# Altium schematic sheet 野火_H743X_核心板_V1.0_底板原理图和PCB参考设计_AD格式.SchDoc
size 419 x 297 mm
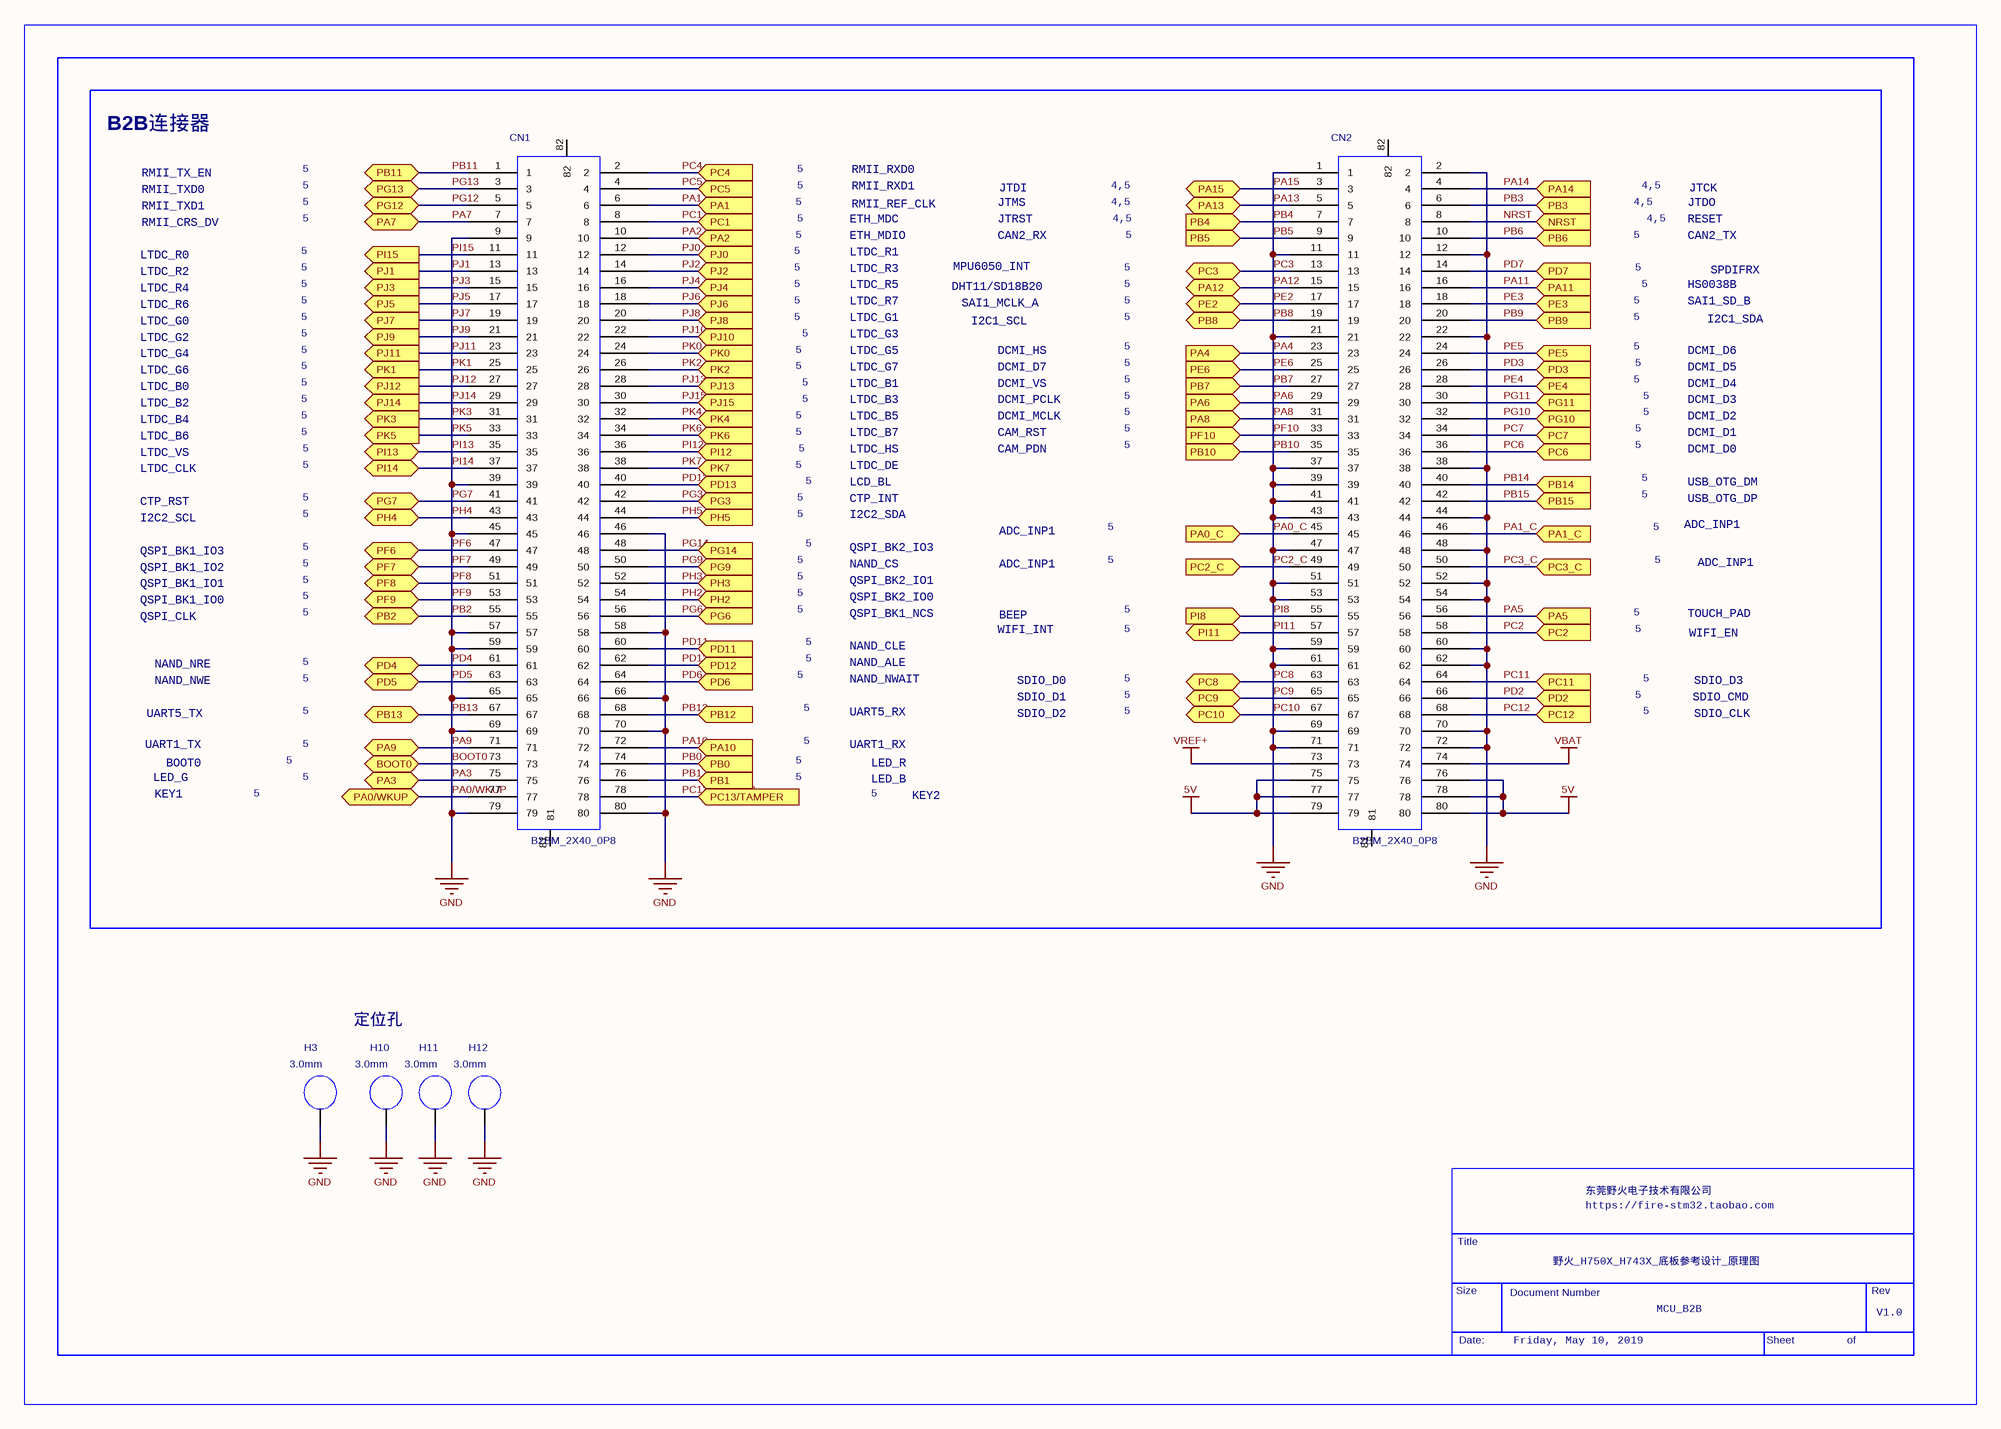
[diagram p0: 野火_H743X_核心板_V1.0_底板原理图和PCB参考设计_AD格式.SchDoc]

## Parts
CN1  value B2BM_2X40_0P8  [B2BM-2X40-0P8]  (hidden comment: B2BF_2X40_0)
CN2  value B2BM_2X40_0P8  [B2BM-2X40-0P8]  (hidden comment: B2BF_2X40_0)
H3  value 3.0mm  [T4R2-6R2_TOPSMT]  (hidden comment: SPACER_0)
H10  value 3.0mm  [T4R2-6R2_TOPSMT]  (hidden comment: SPACER_0)
H11  value 3.0mm  [T4R2-6R2_TOPSMT]  (hidden comment: SPACER_0)
H12  value 3.0mm  [T4R2-6R2_TOPSMT]  (hidden comment: SPACER_0)

## Blocks framed on the sheet
B2B连接器: CN1 CN2

## Ports
BOOT0 (bidir), NRST (in), PA0/WKUP (bidir), PA0_C, PA1 (in), PA1_C, PA2 (in), PA3 (bidir), PA4, PA5 (in), PA6, PA7 (bidir), PA8, PA9 (bidir), PA10, PA11 (in), PA12 (bidir), PA13 (bidir), PA14 (in), PA15 (bidir), PB0 (in), PB1 (in), PB2 (bidir), PB3 (in), PB4, PB5, PB6 (in), PB7, PB8 (bidir), PB9 (in), PB10, PB11 (bidir), PB12, PB13 (bidir), PB14, PB15, PC1 (in), PC2 (in), PC2_C, PC3 (bidir), PC3_C, PC4 (in), PC5 (in), PC6, PC7, PC8 (bidir), PC9 (bidir), PC10 (bidir), PC11 (in), PC12 (in), PC13/TAMPER (in), PD2 (in), PD3, PD4 (bidir), PD5 (bidir), PD6, PD7 (in), PD11, PD12, PD13 (in), PE2 (bidir), PE3 (in), PE4, PE5, PE6, PF6 (bidir), PF7 (bidir), PF8 (bidir), PF9 (bidir), PF10, PG3 (in), PG6, PG7 (bidir), PG9, PG10, PG11, PG12 (bidir), PG13 (bidir), PG14, PH2, PH3, PH4 (bidir), PH5 (in), PI8, PI11 (bidir), PI12 (in), PI13 (bidir), PI14 (bidir), PI15 (out), PJ0 (in), PJ1 (out), PJ2 (in), PJ3 (out), PJ4 (in), PJ5 (out), PJ6 (in), PJ7 (out), PJ8 (in), PJ9 (out), PJ10 (in), PJ11 (out), PJ12 (out), PJ13 (in), PJ14 (out), PJ15 (in), PK0 (in), PK1 (out), PK2 (in), PK3 (out), PK4 (in), PK5 (out), PK6 (in), PK7 (in)

## Nets
5V: CN2.75 CN2.76 CN2.77 CN2.78 CN2.79 CN2.80
BOOT0: CN1.9 CN1.11 CN1.13 CN1.15 CN1.17 CN1.19 CN1.21 CN1.23 CN1.25 CN1.27 CN1.29 CN1.31 CN1.33 CN1.35 CN1.37 CN1.39 CN1.41 CN1.43 CN1.45 CN1.46 CN1.47 CN1.49 CN1.51 CN1.53 CN1.55 CN1.57 CN1.58 CN1.59 CN1.61 CN1.63 CN1.65 CN1.66 CN1.67 CN1.69 CN1.70 CN1.71 CN1.73 CN1.75 CN1.77 CN1.79 CN1.80 CN2.1 CN2.2 CN2.3 CN2.5 CN2.7 CN2.9 CN2.11 CN2.12 CN2.13 CN2.15 CN2.17 CN2.19 CN2.21 CN2.22 CN2.23 CN2.25 CN2.27 CN2.29 CN2.31 CN2.33 CN2.35 CN2.37 CN2.38 CN2.39 CN2.41 CN2.43 CN2.44 CN2.45 CN2.47 CN2.48 CN2.49 CN2.51 CN2.52 CN2.53 CN2.54 CN2.55 CN2.57 CN2.59 CN2.60 CN2.61 CN2.62 CN2.63 CN2.65 CN2.67 CN2.69 CN2.70 CN2.71 CN2.72 H3.1(NC_1) H10.1(NC_1) H11.1(NC_1) H12.1(NC_1) ; port PI8, port PI11, port PA0_C, port PC2_C, port PI15, port PJ1, port PJ3, port PJ5, port PJ7, port PJ9, port PJ11, port PK1, port PJ12, port PJ14, port PK3, port PK5, port PI14, port PI13, port PA0/WKUP, port PG7, port PH4, port PF6, port PF7, port PF8, port PF9, port PA3, port PC8, port PC9, port PC10, port PB2, port BOOT0, port PA9, port PB13, port PD5, port PD4, port PE2, port PA12, port PB8, port PA6, port PA8, port PA4, port PB7, port PE6, port PF10, port PB10, port PC3, port PA15, port PA13, port PB4, port PB5  [also labelled GND, PA0/WKUP, PA0_C, PA12, PA13, PA15, PA3, PA4, PA6, PA8, PA9, PB10, PB13, PB2, PB4, PB5, PB7, PB8, PC10, PC2_C, PC3, PC8, PC9, PD4, PD5, PE2, PE6, PF10, PF6, PF7, PF8, PF9, PG7, PH4, PI11, PI13, PI14, PI15, PI8, PJ1, PJ11, PJ12, PJ14, PJ3, PJ5, PJ7, PJ9, PK1, PK3, PK5]
VBAT: CN2.74
VREF+: CN2.73
NRST: CN2.8 ; port NRST
PA1: CN1.6 ; port PA1
PA1_C: CN2.46 ; port PA1_C
PA2: CN1.10 ; port PA2
PA5: CN2.56 ; port PA5
PA7: CN1.7 ; port PA7
PA10: CN1.72 ; port PA10
PA11: CN2.16 ; port PA11
PA14: CN2.4 ; port PA14
PB0: CN1.74 ; port PB0
PB1: CN1.76 ; port PB1
PB3: CN2.6 ; port PB3
PB6: CN2.10 ; port PB6
PB9: CN2.20 ; port PB9
PB11: CN1.1 ; port PB11
PB12: CN1.68 ; port PB12
PB14: CN2.40 ; port PB14
PB15: CN2.42 ; port PB15
PC1: CN1.8 ; port PC1
PC2: CN2.58 ; port PC2
PC3_C: CN2.50 ; port PC3_C
PC4: CN1.2 ; port PC4
PC5: CN1.4 ; port PC5
PC6: CN2.36 ; port PC6
PC7: CN2.34 ; port PC7
PC11: CN2.64 ; port PC11
PC12: CN2.68 ; port PC12
PC13/TAMPER: CN1.78 ; port PC13/TAMPER
PD2: CN2.66 ; port PD2
PD3: CN2.26 ; port PD3
PD6: CN1.64 ; port PD6
PD7: CN2.14 ; port PD7
PD11: CN1.60 ; port PD11
PD12: CN1.62 ; port PD12
PD13: CN1.40 ; port PD13
PE3: CN2.18 ; port PE3
PE4: CN2.28 ; port PE4
PE5: CN2.24 ; port PE5
PG3: CN1.42 ; port PG3
PG6: CN1.56 ; port PG6
PG9: CN1.50 ; port PG9
PG10: CN2.32 ; port PG10
PG11: CN2.30 ; port PG11
PG12: CN1.5 ; port PG12
PG13: CN1.3 ; port PG13
PG14: CN1.48 ; port PG14
PH2: CN1.54 ; port PH2
PH3: CN1.52 ; port PH3
PH5: CN1.44 ; port PH5
PI12: CN1.36 ; port PI12
PJ0: CN1.12 ; port PJ0
PJ2: CN1.14 ; port PJ2
PJ4: CN1.16 ; port PJ4
PJ6: CN1.18 ; port PJ6
PJ8: CN1.20 ; port PJ8
PJ10: CN1.22 ; port PJ10
PJ13: CN1.28 ; port PJ13
PJ15: CN1.30 ; port PJ15
PK0: CN1.24 ; port PK0
PK2: CN1.26 ; port PK2
PK4: CN1.32 ; port PK4
PK6: CN1.34 ; port PK6
PK7: CN1.38 ; port PK7

Not connected (* = marked no-connect by the designer): CN1 81 82; CN2 81 82

## Notes on the sheet
- RMII_TX_EN
- RMII_TXD0
- 5
- RMII_RXD1
- RMII_REF_CLK
- RMII_RXD0
- JTMS
- JTDI
- 4,5
- JTDO
- JTCK
- LTDC_R0
- LTDC_R2
- LTDC_R4
- RMII_CRS_DV
- RMII_TXD1
- ETH_MDIO
- ETH_MDC
- LTDC_R3
- LTDC_R5
- LTDC_R1
- DHT11/SD18B20
- MPU6050_INT
- JTRST
- CAN2_RX
- HS0038B
- RESET
- CAN2_TX
- SPDIFRX
- LTDC_G0
- LTDC_G2
- LTDC_G4
- LTDC_R6
- LTDC_G3
- LTDC_G5
- LTDC_G7
- LTDC_G1
- LTDC_R7
- SAI1_MCLK_A
- I2C1_SCL
- DCMI_D7
- DCMI_HS
- SAI1_SD_B
- DCMI_D5
- DCMI_D6
- I2C1_SDA
- LTDC_G6
- LTDC_B0
- LTDC_B2
- LTDC_B4
- LTDC_B6
- LTDC_VS
- LTDC_B3
- LTDC_B5
- LTDC_B7
- LTDC_HS
- LTDC_B1
- DCMI_VS
- DCMI_PCLK
- DCMI_MCLK
- CAM_RST
- CAM_PDN
- DCMI_D4
- DCMI_D3
- DCMI_D2
- DCMI_D1
- DCMI_D0
- LTDC_CLK
- CTP_RST
- I2C2_SCL
- LTDC_DE
- LCD_BL
- CTP_INT
- I2C2_SDA
- ADC_INP1
- USB_OTG_DP
- USB_OTG_DM
- QSPI_BK1_IO3
- QSPI_BK1_IO2
- QSPI_BK1_IO1
- QSPI_BK1_IO0
- QSPI_CLK
- QSPI_BK2_IO3
- NAND_CS
- QSPI_BK2_IO1
- QSPI_BK2_IO0
- QSPI_BK1_NCS
- BEEP
- TOUCH_PAD
- NAND_NWE
- NAND_NRE
- NAND_CLE
- NAND_ALE
- NAND_NWAIT
- WIFI_INT
- SDIO_D1
- SDIO_D0
- WIFI_EN
- SDIO_CMD
- SDIO_D3
- UART1_TX
- UART5_TX
- LED_G
- BOOT0
- UART1_RX
- UART5_RX
- LED_B
- LED_R
- SDIO_D2
- SDIO_CLK
- KEY1
- KEY2
- 定位孔
- 东莞野火电子技术有限公司
- Title
- 野火_H750X_H743X_底板参考设计_原理图
- https://fire-stm32.taobao.com
- Size
- Date:
- Document Number
- Friday, May 10, 2019
- MCU_B2B
- Sheet
- of
- Rev
- V1.0

## Library data of the parts
CN1 CN2 = B2BF_2X40_0: Source_Path: F:\STM32\H750\SCH\野火_H750 PRO底板_原理图_V1_0.DSN; PCB DECAL: B2BM-2X40-0P8
H3 H10 = SPACER_0: FASTENER, STANDOFF 4.5MMX3.53XM3.0X0.5 ROUND THR .635"L BRASS; AGILE_PN: 280-76498; MFG_NAME01: UNICORP; MFG_PN01: MSS251-R-1-A-16; ASSY_OPT: DNP; CAD_APPROVED: Yes; Source_Path: H:\NXP_RT1050\SCH\IMXRT1052.DSN; CLASS: IC; ROHS: Yes; HEIGHT: 16.13MM; PCB DECAL: T4R2-6R2_TOPSMT
H11 H12 = SPACER_0: FASTENER, STANDOFF 4.5MMX3.53XM3.0X0.5 ROUND THR .635"L BRASS; CAD_APPROVED: Yes; ASSY_OPT: DNP; MFG_PN01: MSS251-R-1-A-16; MFG_NAME01: UNICORP; AGILE_PN: 280-76498; Source_Path: H:\NXP_RT1050\SCH\IMXRT1052.DSN; CLASS: IC; HEIGHT: 16.13MM; ROHS: Yes; PCB DECAL: T4R2-6R2_TOPSMT